# Altium schematic sheet FPGA power supply.SchDoc: FPGA Power Supply
size A3; Organization: Blinkinlabs, LLC; DocumentNumber: 9; SheetNumber: 9; SheetTotal: 14
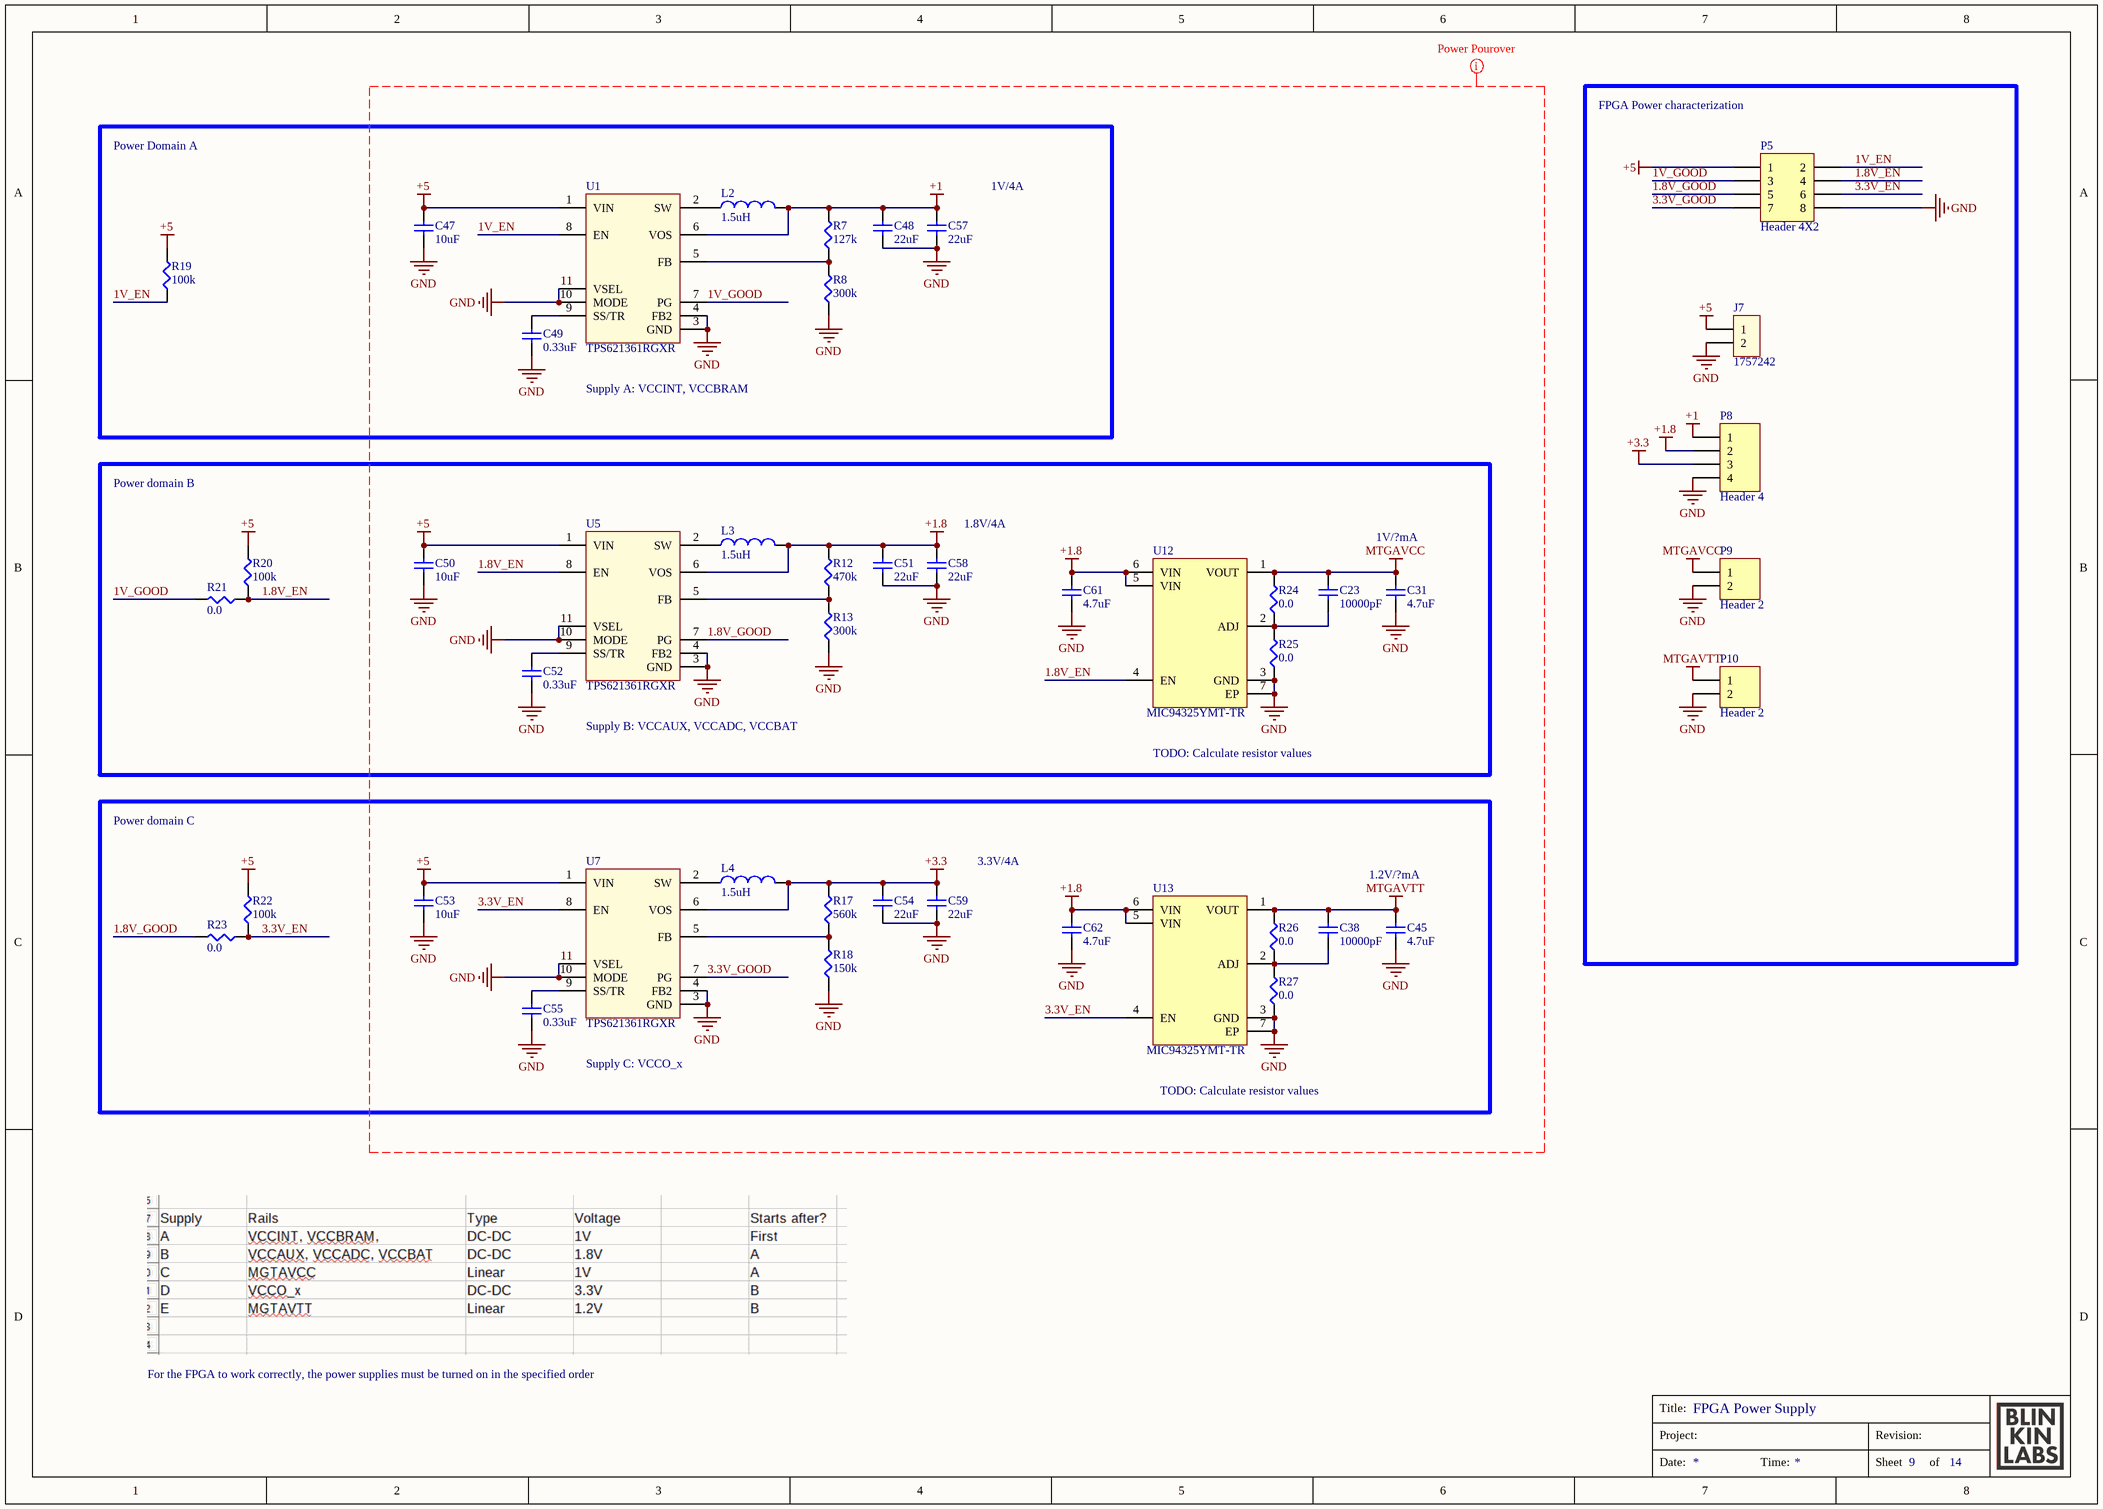
[diagram p0: FPGA power supply.SchDoc]

## Parts
C23  10000pF  [CAPC1005X06L]
C31  4.7uF  [CAPC1005X06L]
C38  10000pF  [CAPC1005X06L]
C45  4.7uF  [CAPC1005X06L]
C47  10uF  [CAPC2012X10L]
C48  22uF  [CAPC2012X10L]
C49  0.33uF  [CAPC1005X06L]
C50  10uF  [CAPC2012X10L]
C51  22uF  [CAPC2012X10L]
C52  0.33uF  [CAPC1005X06L]
C53  10uF  [CAPC2012X10L]
C54  22uF  [CAPC2012X10L]
C55  0.33uF  [CAPC1005X06L]
C57  22uF  [CAPC2012X10L]
C58  22uF  [CAPC2012X10L]
C59  22uF  [CAPC2012X10L]
C61  4.7uF  [CAPC1005X06L]
C62  4.7uF  [CAPC1005X06L]
J7  1757242  [1757242]
L2  1.5uH  [SWPA4030S]
L3  1.5uH  [SWPA4030S]
L4  1.5uH  [SWPA4030S]
P5  Header 4X2  [HDR2X4]
P8  Header 4  [HDR1X4]
P9  Header 2  [HDR1X2]
P10  Header 2  [HDR1X2]
R7  127k  [ERJ2G(0402)_L]
R8  300k  [ERJ2G(0402)_L]
R12  470k  [ERJ2G(0402)_L]
R13  300k  [ERJ2G(0402)_L]
R17  560k  [ERJ2G(0402)_L]
R18  150k  [ERJ2G(0402)_L]
R19  100k  [ERJ2G(0402)_L]
R20  100k  [ERJ2G(0402)_L]
R21  0.0  [ERJ2G(0402)_L]
R22  100k  [ERJ2G(0402)_L]
R23  0.0  [ERJ2G(0402)_L]
R24  0.0  [ERJ2G(0402)_L]
R25  0.0  [ERJ2G(0402)_L]
R26  0.0  [ERJ2G(0402)_L]
R27  0.0  [ERJ2G(0402)_L]
U1  TPS621361RGXR  [RGX0011A]
U5  TPS621361RGXR  [RGX0011A]
U7  TPS621361RGXR  [RGX0011A]
U12  MIC94325YMT-TR  [QFN50P160X160X60_HS-7N]
U13  MIC94325YMT-TR  [QFN50P160X160X60_HS-7N]

## Blocks framed on the sheet
FPGA Power characterization: J7 P5 P8-P10

## Nets
+1: C48.1 C57.1 L2.2 P8.1 R7.2 U1.6(VOS)
+1.8: C51.1 C58.1 C61.2 C62.2 L3.2 P8.2 R12.2 U5.6(VOS) U12.5(VIN) U12.6(VIN) U13.5(VIN) U13.6(VIN)
+3.3: C54.1 C59.1 L4.2 P8.3 R17.2 U7.6(VOS)
+5: C47.1 C50.1 C53.1 J7.1 P5.1 R19.2 R20.2 R22.2 U1.1(VIN) U5.1(VIN) U7.1(VIN)
GND: C31.1 C45.1 C47.2 C48.2 C49.2 C50.2 C51.2 C52.2 C53.2 C54.2 C55.2 C57.2 C58.2 C59.2 C61.1 C62.1 J7.2 P5.8 P8.4 P9.2 P10.2 R8.1 R13.1 R18.1 R25.1 R27.1 U1.3(GND) U1.4(FB2) U1.10(MODE) U1.11(VSEL) U5.3(GND) U5.4(FB2) U5.10(MODE) U5.11(VSEL) U7.3(GND) U7.4(FB2) U7.10(MODE) U7.11(VSEL) U12.3(GND) U12.7(EP) U13.3(GND) U13.7(EP)
MTGAVCC: C23.1 C31.2 P9.1 R24.2 U12.1(VOUT)
MTGAVTT: C38.1 C45.2 P10.1 R26.2 U13.1(VOUT)
1.8V_EN: P5.4 R20.1 R21.1 U5.8(EN) U12.4(EN)
1.8V_GOOD: P5.5 R23.2 U5.7(PG)
1V_EN: P5.2 R19.1 U1.8(EN)
1V_GOOD: P5.3 R21.2 U1.7(PG)
3.3V_EN: P5.6 R22.1 R23.1 U7.8(EN) U13.4(EN)
3.3V_GOOD: P5.7 U7.7(PG)
NetC23_2: C23.2 R24.1 R25.2 U12.2(ADJ)
NetC38_2: C38.2 R26.1 R27.2 U13.2(ADJ)
NetC49_1: C49.1 U1.9(SS/TR)
NetC52_1: C52.1 U5.9(SS/TR)
NetC55_1: C55.1 U7.9(SS/TR)
NetL2_1: L2.1 U1.2(SW)
NetL3_1: L3.1 U5.2(SW)
NetL4_1: L4.1 U7.2(SW)
NetR7_1: R7.1 R8.2 U1.5(FB)
NetR12_1: R12.1 R13.2 U5.5(FB)
NetR17_1: R17.1 R18.2 U7.5(FB)

## Layout directives
rule Polygon Connect Style [Style - Direct Connect]: 1.8V_EN, 1.8V_GOOD, 1V_EN, 1V_GOOD, 3.3V_EN, 3.3V_GOOD, +1, +1.8, +3.3, +5, GND, MTGAVCC, MTGAVTT

## Notes on the sheet
- Power Domain A
- 1V/4A
- Supply A: VCCINT, VCCBRAM
- Power domain B
- (near C58) 1.8V/4A
- 1V/?mA
- Supply B: VCCAUX, VCCADC, VCCBAT
- TODO: Calculate resistor values
- Power domain C
- 3.3V/4A
- 1.2V/?mA
- Supply C: VCCO_x
- For the FPGA to work correctly, the power supplies must be turned on in the specified order
- Title:
- Project:
- Revision:
- Date:
- Time:
- Sheet
- of

## Library data of the parts
C23 C38 = GRM155R71C103KA01D: CAP CER 10000PF 16V X7R 0402; Manufacturer: Murata Electronics North America; Tolerance: ±10%; PartNumber: GRM155R71C103KA01D; Datasheets: http://www.murata.com/~/media/webrenewal/support/library/catalog/products/capacitor/mlcc/c02e.pdf; Image: //media.digikey.com/Renders/Murata%20Renders/ZRB-SERIES-0402.jpg; Digi-Key Part Number: 490-1313-1-ND; Packaging: Cut Tape (CT); Series: GRM; Value: 10000pF; Voltage: 16V; Temperature Coefficient: X7R; Operating Temperature: -55°C ~ 125°C; Features: -; Applications: General Purpose; Package / Case: 0402 (1005 Metric); Case/Package: 0402
C31 C45 C61 C62 = GRM155R60G475ME47D: CAP CER 4.7UF 4V X5R 0402; Manufacturer: Murata Electronics North America; Tolerance: ±20%; PartNumber: GRM155R60G475ME47D; Datasheets: http://www.murata.com/~/media/webrenewal/support/library/catalog/products/capacitor/mlcc/c02e.pdf; Image: //media.digikey.com/Renders/Murata%20Renders/ZRB-SERIES-0402.jpg; Digi-Key Part Number: 490-11980-1-ND; Packaging: Cut Tape (CT); Series: GRM; Value: 4.7uF; Voltage: 4V; Temperature Coefficient: X5R; Operating Temperature: -55°C ~ 85°C; Features: -; Applications: General Purpose; Package / Case: 0402 (1005 Metric); Case/Package: 0402
C47 C50 C53 = GRM21BR71A106KE51L: CAP CER 10UF 10V X7R 0805; Manufacturer: Murata Electronics North America; Tolerance: ±10%; PartNumber: GRM21BR71A106KE51L; Datasheets: http://www.murata.com/~/media/webrenewal/support/library/catalog/products/capacitor/mlcc/c02e.pdf; Image: //media.digikey.com/Renders/Murata%20Renders/0805%20(2012%20Metric)%20.85mm.jpg; Digi-Key Part Number: 490-3905-1-ND; Series: GRM; Part Status: Active; Value: 10uF; Voltage: 10V; Temperature Coefficient: X7R; Operating Temperature: -55°C ~ 125°C; Features: -; Applications: General Purpose; Mounting Type: Surface Mount, MLCC; Package / Case: 0805 (2012 Metric); Case/Package: 0805
C48 C51 C54 C57-C59 = GRM219R61A226MEA0D: CAP CER 22UF 10V X5R 0805; Manufacturer: Murata Electronics North America; Tolerance: ±20%; PartNumber: GRM219R61A226MEA0D; Datasheets: http://www.murata.com/~/media/webrenewal/support/library/catalog/products/capacitor/mlcc/c02e.pdf; Image: //media.digikey.com/Renders/Murata%20Renders/0805%20(2012%20Metric)%20.85mm.jpg; Digi-Key Part Number: 490-9951-1-ND; Series: GRM; Part Status: Active; Value: 22uF; Voltage: 10V; Temperature Coefficient: X5R; Operating Temperature: -55°C ~ 85°C; Features: Derating Recommended; Applications: General Purpose; Mounting Type: Surface Mount, MLCC; Package / Case: 0805 (2012 Metric); Case/Package: 0805
C49 C52 C55 = GRM155R60J334KE01D: CAP CER 0.33UF 6.3V X5R 0402; Manufacturer: Murata Electronics North America; Tolerance: ±10%; PartNumber: GRM155R60J334KE01D; Datasheets: http://www.murata.com/~/media/webrenewal/support/library/catalog/products/capacitor/mlcc/c02e.pdf; Image: //media.digikey.com/Renders/Murata%20Renders/ZRB-SERIES-0402.jpg; Digi-Key Part Number: 490-3265-1-ND; Packaging: Cut Tape (CT); Series: GRM; Value: 0.33uF; Voltage: 6.3V; Temperature Coefficient: X5R; Operating Temperature: -55°C ~ 85°C; Features: -; Applications: General Purpose; Package / Case: 0402 (1005 Metric); Case/Package: 0402
J7 = 1757242: TERM BLOCK HDR 2POS 90DEG 5.08MM; Manufacturer: Phoenix Contact; PartNumber: 1757268; ComponentLink2Description: Datasheet; ComponentLink2URL: 1757268_06_en_00.pdf
L2-L4 = SWPA4030S1R5NT: 1.5uH ±20% 3.34A 26mΩ SMD,4.0x4.0x3.0mm Power Inductors RoHS; Manufacturer: Sunlord; PartNumber: SWPA4030S1R5NT; Datasheets: https://datasheet.lcsc.com/szlcsc/1810161020_Sunlord-SWPA4030S1R5NT_C42100.pdf; LCSC PartNumber: C42100; Inductance: 1.5uH; Tolerance: ±20%; DC Resistance: 26mΩ; Saturation current: 3.34A; Packaging: Cut Tape (CT); Package / Case: SMD,4.0x4.0x3.0mm; Case/Package: SMD,4.0x4.0x3.0mm
P5 = Header 4X2: Header, 4-Pin, Dual row; LatestRevisionDate: 17-Jul-2002; LatestRevisionNote: Re-released for DXP Platform.; Publisher: Altium Limited
P8 = Header 4: Header, 4-Pin; LatestRevisionDate: 17-Jul-2002; LatestRevisionNote: Re-released for DXP Platform.; Publisher: Altium Limited
P9 P10 = Header 2: Header, 2-Pin; LatestRevisionDate: 17-Jul-2002; LatestRevisionNote: Re-released for DXP Platform.; Publisher: Altium Limited
R7 = ERJ-2RKF1273X: RES SMD 127K OHM 1% 1/10W 0402; Manufacturer: Panasonic Electronic Components; Power (Watts): 0.1W, 1/10W; Temperature Coefficient: ±100ppm/°C; PartNumber: ERJ-2RKF1273X; Datasheets: http://industrial.panasonic.com/www-cgi/jvcr13pz.cgi?E+PZ+3+AOA0002+ERJ2RKF1273X+7+WW; Image: //media.digikey.com/Photos/Panasonic%20Photos/ERJ-PA2-Series.jpg; Digi-Key Part Number: P127KLCT-ND; Series: ERJ; Value: 127k; Tolerance: ±1%; Composition: Thick Film; Features: Automotive AEC-Q200; Operating Temperature: -55°C ~ 155°C; Package / Case: 0402 (1005 Metric); Case/Package: 0402; Size / Dimension: 0.039" L x 0.020" W (1.00mm x 0.50mm); Height - Seated (Max): 0.016" (0.40mm); Number of Terminations: 2
R8 R13 = ERJ-2RKF3003X: RES SMD 300K OHM 1% 1/10W 0402; Manufacturer: Panasonic Electronic Components; Power (Watts): 0.1W, 1/10W; Temperature Coefficient: ±100ppm/°C; PartNumber: ERJ-2RKF3003X; Datasheets: http://industrial.panasonic.com/www-cgi/jvcr13pz.cgi?E+PZ+3+AOA0002+ERJ2RKF3003X+7+WW; Image: //media.digikey.com/Photos/Panasonic%20Photos/ERJ-PA2-Series.jpg; Digi-Key Part Number: P300KLCT-ND; Series: ERJ; Value: 300k; Tolerance: ±1%; Composition: Thick Film; Features: Automotive AEC-Q200; Operating Temperature: -55°C ~ 155°C; Package / Case: 0402 (1005 Metric); Case/Package: 0402; Size / Dimension: 0.039" L x 0.020" W (1.00mm x 0.50mm); Height - Seated (Max): 0.016" (0.40mm); Number of Terminations: 2
R12 = ERJ-PA2F4703X: RES SMD 470K OHM 1% 1/5W 0402; Manufacturer: Panasonic Electronic Components; Power (Watts): 0.2W, 1/5W; Temperature Coefficient: ±100ppm/°C; PartNumber: ERJ-PA2F4703X; Datasheets: https://industrial.panasonic.com/cdbs/www-data/pdf/RDA0000/AOA0000C243.pdf; Image: //media.digikey.com/Photos/Panasonic%20Photos/ERJ-PA2-Series.jpg; Digi-Key Part Number: P17240CT-ND; Series: ERJ; Value: 470k; Tolerance: ±1%; Composition: Thick Film; Features: Automotive AEC-Q200, Pulse Withstanding; Operating Temperature: -55°C ~ 155°C; Package / Case: 0402 (1005 Metric); Case/Package: 0402; Size / Dimension: 0.039" L x 0.020" W (1.00mm x 0.50mm); Height - Seated (Max): 0.016" (0.40mm); Number of Terminations: 2
R17 = ERJ-2RKF5603X: RES SMD 560K OHM 1% 1/10W 0402; Manufacturer: Panasonic Electronic Components; Power (Watts): 0.1W, 1/10W; Temperature Coefficient: ±100ppm/°C; PartNumber: ERJ-2RKF5603X; Datasheets: http://industrial.panasonic.com/www-cgi/jvcr13pz.cgi?E+PZ+3+AOA0002+ERJ2RKF5603X+7+WW; Image: //media.digikey.com/Photos/Panasonic%20Photos/ERJ-PA2-Series.jpg; Digi-Key Part Number: P560KLCT-ND; Series: ERJ; Value: 560k; Tolerance: ±1%; Composition: Thick Film; Features: Automotive AEC-Q200; Operating Temperature: -55°C ~ 155°C; Package / Case: 0402 (1005 Metric); Case/Package: 0402; Size / Dimension: 0.039" L x 0.020" W (1.00mm x 0.50mm); Height - Seated (Max): 0.016" (0.40mm); Number of Terminations: 2
R18 = ERJ-PA2F1503X: RES SMD 150K OHM 1% 1/5W 0402; Manufacturer: Panasonic Electronic Components; Power (Watts): 0.2W, 1/5W; Temperature Coefficient: ±100ppm/°C; PartNumber: ERJ-PA2F1503X; Datasheets: https://industrial.panasonic.com/cdbs/www-data/pdf/RDA0000/AOA0000C243.pdf; Image: //media.digikey.com/Photos/Panasonic%20Photos/ERJ-PA2-Series.jpg; Digi-Key Part Number: P17237CT-ND; Series: ERJ; Value: 150k; Tolerance: ±1%; Composition: Thick Film; Features: Automotive AEC-Q200, Pulse Withstanding; Operating Temperature: -55°C ~ 155°C; Package / Case: 0402 (1005 Metric); Case/Package: 0402; Size / Dimension: 0.039" L x 0.020" W (1.00mm x 0.50mm); Height - Seated (Max): 0.016" (0.40mm); Number of Terminations: 2
R19 R20 R22 = ERJ-PA2F1003X: RES SMD 100K OHM 1% 1/5W 0402; Manufacturer: Panasonic Electronic Components; Power (Watts): 0.2W, 1/5W; Temperature Coefficient: ±100ppm/°C; PartNumber: ERJ-PA2F1003X; Datasheets: https://industrial.panasonic.com/cdbs/www-data/pdf/RDA0000/AOA0000C243.pdf; Image: //media.digikey.com/Photos/Panasonic%20Photos/ERJ-PA2-Series.jpg; Digi-Key Part Number: P17236CT-ND; Series: ERJ; Value: 100k; Tolerance: ±1%; Composition: Thick Film; Features: Automotive AEC-Q200, Pulse Withstanding; Operating Temperature: -55°C ~ 155°C; Package / Case: 0402 (1005 Metric); Case/Package: 0402; Size / Dimension: 0.039" L x 0.020" W (1.00mm x 0.50mm); Height - Seated (Max): 0.016" (0.40mm); Number of Terminations: 2
R21 R23-R27 = ERJ-2GE0R00X: RES SMD 0.0OHM JUMPER 1/10W 0402; Manufacturer: Panasonic Electronic Components; Power (Watts): 0.1W, 1/10W; PartNumber: ERJ-2GE0R00X; Datasheets: http://industrial.panasonic.com/www-cgi/jvcr13pz.cgi?E+PZ+3+AOA0001+ERJ2GE0R00X+7+WW; Image: //media.digikey.com/Photos/Panasonic%20Photos/ERJ-PA2-Series.jpg; Digi-Key Part Number: P0.0JCT-ND; Series: ERJ; Value: 0.0; Tolerance: Jumper; Composition: Thick Film; Features: Automotive AEC-Q200; Temperature Coefficient: -; Operating Temperature: -55°C ~ 155°C; Package / Case: 0402 (1005 Metric); Case/Package: 0402; Size / Dimension: 0.039" L x 0.020" W (1.00mm x 0.50mm); Height - Seated (Max): 0.016" (0.40mm); Number of Terminations: 2
U1 U5 U7 = TPS621361RGXR: IC REG BUCK ADJUSTABLE 4A 11VQFN; Manufacturer: Texas Instruments; PartNumber: TPS621361RGXR; Digikey PartNumber: 296-50117-2-ND
U12 U13 = MIC94325YMT-TR: 500mA LDO with  Ripple Blocker Technology; Manufacturer: Microchip Technology; PartNumber: MIC94325YMT-TR; Digikey PartNumber: 576-4164-2-ND